# EAGLE design DMGC-IPS-01_2-4 (EAGLE 9.6.2)
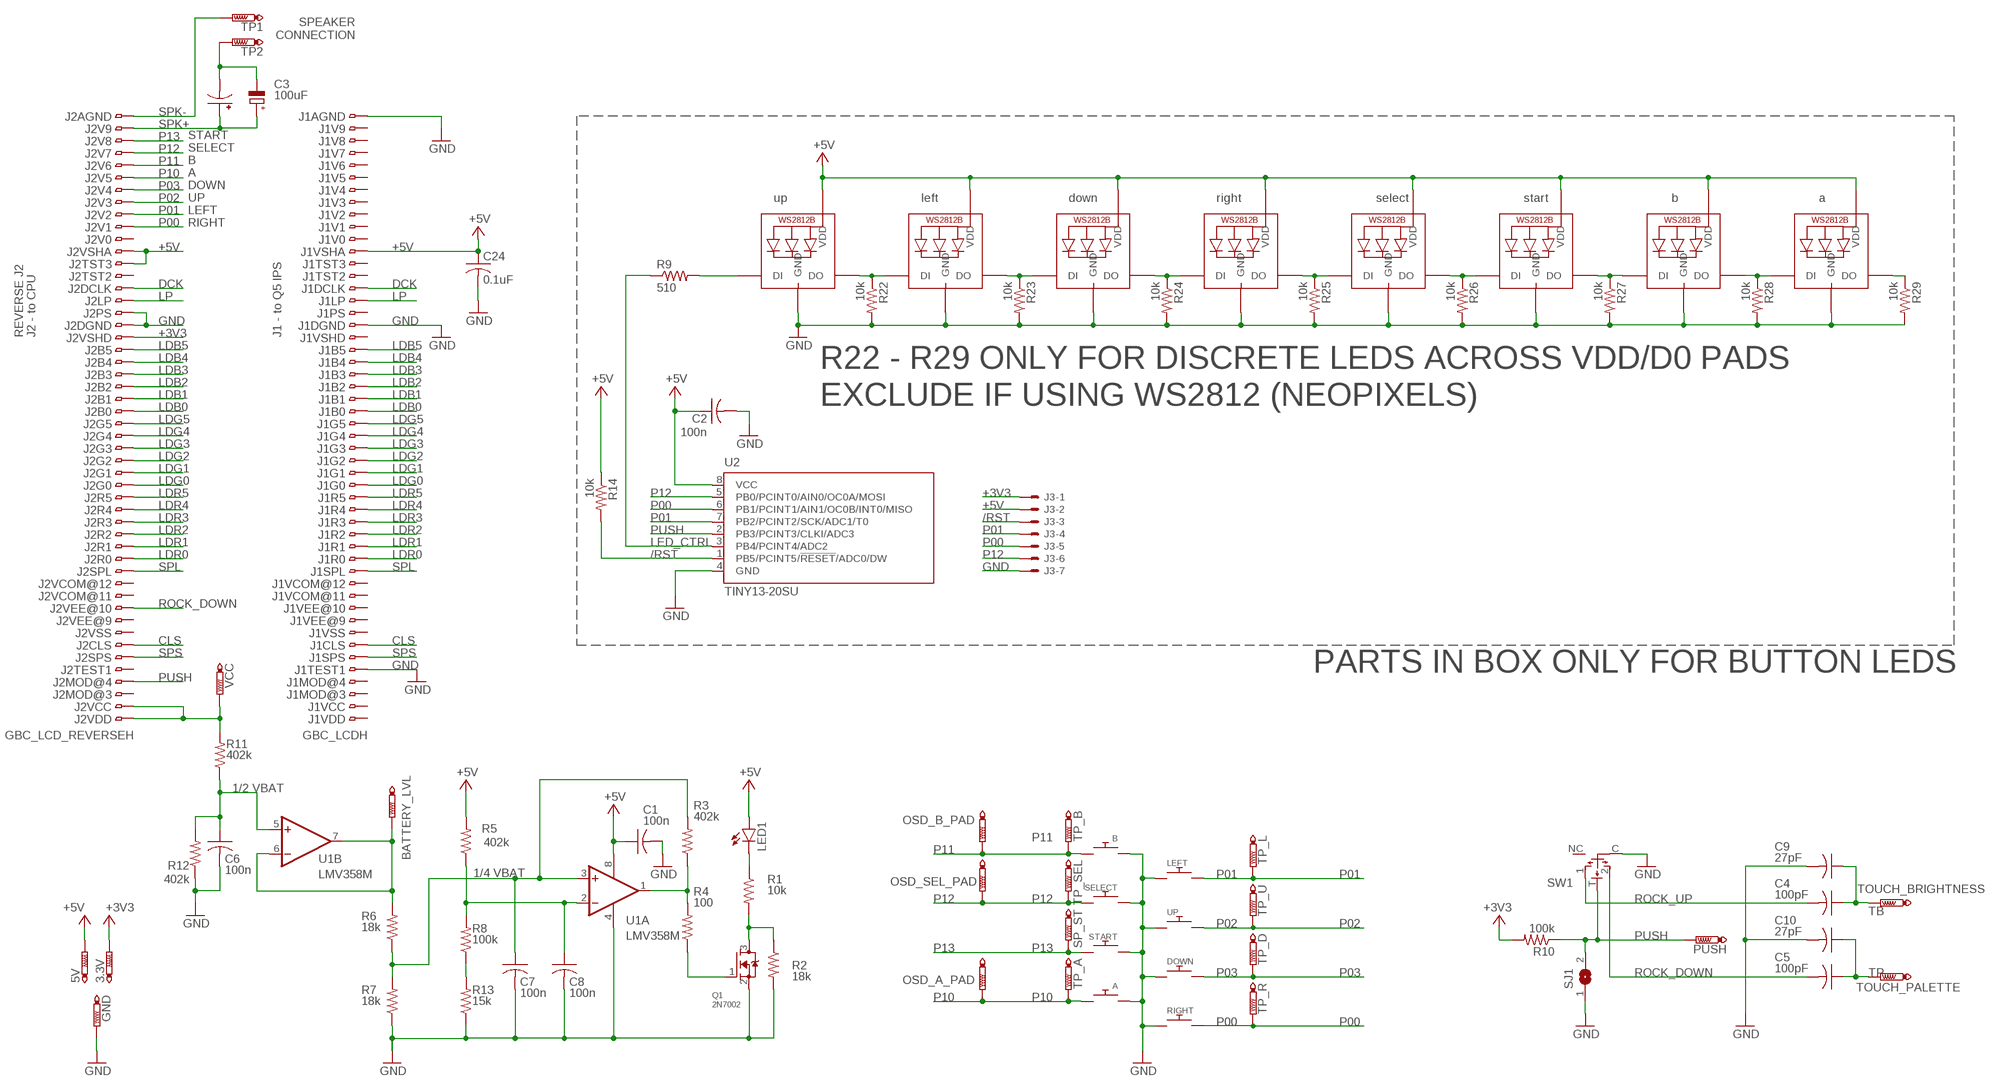
[diagram p0: schematic, sheet 1]

## Parts
3.3V  PTR1TP20R  [TP20R]
5V  PTR1TP20R  [TP20R]
A  DMG-BTN  DMG_BTN1  [DMG_BTN1]
B  DMG-BTN  DMG_BTN1  [DMG_BTN1]
BATTERY_LVL  PTR1TP20R  [TP20R]
C1  100n  C-USC0603  [C0603]
C2  100n  C-USC0603  [C0603]
C3  100uF  CPOL-USCT3528  [CT3528]
C3TH  CPOL-EUE2,5-6E  [E2,5-6E]
C4  100pF  C-USC0603  [C0603]
C5  100pF  C-USC0603  [C0603]
C6  100n  C-USC0603  [C0603]
C7  100n  C-USC0603  [C0603]
C8  100n  C-USC0603  [C0603]
C9  27pF  C-USC0603  [C0603]
C10  27pF  C-USC0603  [C0603]
C24  0.1uF  C-USC0603  [C0603]
DOWN  DMG-BTN  DMG_BTN1  [DMG_BTN1]
GND  PTR1TP20R  [TP20R]
J1  GBC_LCDH  [62684-502100AHLF]
J2  GBC_LCD_REVERSEH  [62684-502100AHLF_REVERSE]
J3  C-GRID-07-15-91  [15-91-07]
LED1  LED3MM  [LED3MM]
LED10  WS2812B3535  [LED3535]
LED11  WS2812B3535  [LED3535]
LED12  WS2812B3535  [LED3535]
LED13  WS2812B3535  [LED3535]
LED14  WS2812B3535  [LED3535]
LED15  WS2812B3535  [LED3535]
LED16  WS2812B3535  [LED3535]
LED17  WS2812B3535  [LED3535]
LEFT  DMG-BTN  DMG_BTN1  [DMG_BTN1]
OSD_A_PAD  PTR1TP20R  [TP20R]
OSD_B_PAD  PTR1TP20R  [TP20R]
OSD_SEL_PAD  PTR1TP20R  [TP20R]
PUSH  PTR1TP20R  [TP20R]
Q1  2N7002  MOSFET-NREFLOW  [SOT23]
R1  10k  R-US_R0603  [R0603]
R2  18k  R-US_R0603  [R0603]
R3  402k  R-US_R0603  [R0603]
R4  100  R-US_R0603  [R0603]
R5  402k  R-US_R0603  [R0603]
R6  18k  R-US_R0603  [R0603]
R7  18k  R-US_R0603  [R0603]
R8  100k  R-US_R0603  [R0603]
R9  510  R-US_R0603  [R0603]
R10  100k  R-US_R0603  [R0603]
R11  402k  R-US_R0603  [R0603]
R12  402k  R-US_R0603  [R0603]
R13  15k  R-US_R0603  [R0603]
R14  10k  R-US_R0603  [R0603]
R22  10k  R-US_R0603  [R0603]
R23  10k  R-US_R0603  [R0603]
R24  10k  R-US_R0603  [R0603]
R25  10k  R-US_R0603  [R0603]
R26  10k  R-US_R0603  [R0603]
R27  10k  R-US_R0603  [R0603]
R28  10k  R-US_R0603  [R0603]
R29  10k  R-US_R0603  [R0603]
RIGHT  DMG-BTN  DMG_BTN1  [DMG_BTN1]
SELECT  DMG-BTN  DMG_BTN2_TACT2  [DMG_BTN2_TACT2]
SJ1  SJ  [SJ]
SP_ST  PTR1TP20R  [TP20R]
START  DMG-BTN  DMG_BTN2_TACT2  [DMG_BTN2_TACT2]
SW1  NAV_SWITCH  [NAV_SWITCH]
TOUCH_BRIGHTNESS  PTR1TP20R  [TP20R]
TOUCH_PALETTE  PTR1TP20R  [TP20R]
TP1  PTR1PAD1-13  [P1-13]
TP2  PTR1PAD1-13  [P1-13]
TP_A  PTR1TP20R  [TP20R]
TP_B  PTR1TP20R  [TP20R]
TP_D  PTR1TP20R  [TP20R]
TP_L  PTR1TP20R  [TP20R]
TP_R  PTR1TP20R  [TP20R]
TP_SEL  PTR1TP20R  [TP20R]
TP_U  PTR1TP20R  [TP20R]
U1  LMV358M  [SO08]
U2  TINY13-20SU  [8S2]
UP  DMG-BTN  DMG_BTN1  [DMG_BTN1]
VCC  PTR1TP20R  [TP20R]

## Nets
+3V3: 3.3V.TP J2.19 J3.1 R10.2
+5V: 5V.TP C1.1 C2.1 C24.1 J1.39 J2.12 J2.13 J3.2 LED1.A LED10.4(VDD) LED11.4(VDD) LED12.4(VDD) LED13.4(VDD) LED14.4(VDD) LED15.4(VDD) LED16.4(VDD) LED17.4(VDD) R5.2 R14.1 U1.8(P:V+) U2.8(VCC)
/RST: J3.3 R14.2 U2.1(PB5/PCINT5/!RESET!/ADC0/DW)
BATT: J2.49 J2.50 R11.2 VCC.TP
CLS: J1.7 J2.44
DCK: J1.36 J2.15
GND: A.P$2 B.P$2 C1.2 C2.2 C6.2 C7.2 C8.2 C9.2 C10.2 C24.2 DOWN.P$2 GND.TP J1.5 J1.33 J1.50 J2.17 J2.18 J3.7 LED10.2(GND) LED11.2(GND) LED12.2(GND) LED13.2(GND) LED14.2(GND) LED15.2(GND) LED16.2(GND) LED17.2(GND) LEFT.P$2 Q1.2(S) R2.2 R7.1 R12.1 R13.1 R22.2 R23.2 R24.2 R25.2 R26.2 R27.2 R28.2 R29.2 RIGHT.P$2 SELECT.P$1 SJ1.1 START.P$1 SW1.C U1.4(P:V-) U2.4(GND) UP.P$2
LDB0: J1.26 J2.25
LDB1: J1.27 J2.24
LDB2: J1.28 J2.23
LDB3: J1.29 J2.22
LDB4: J1.30 J2.21
LDB5: J1.31 J2.20
LDG0: J1.20 J2.31
LDG1: J1.21 J2.30
LDG2: J1.22 J2.29
LDG3: J1.23 J2.28
LDG4: J1.24 J2.27
LDG5: J1.25 J2.26
LDR0: J1.14 J2.37
LDR1: J1.15 J2.36
LDR2: J1.16 J2.35
LDR3: J1.17 J2.34
LDR4: J1.18 J2.33
LDR5: J1.19 J2.32
LED_CTRL: R9.1 U2.3(PB4/PCINT4/ADC2)
LP: J1.35 J2.16
N$1: Q1.3(D) R1.2 R2.1
N$2: LED1.K(C) R1.1
N$3: BATTERY_LVL.TP R6.2 U1.6(B:-IN) U1.7(B:OUT)
N$4: LED13.1(DO) LED16.3(DI) R27.1
N$5: LED15.3(DI) LED16.1(DO) R28.1
N$6: LED10.1(DO) LED14.3(DI) R22.1
N$7: C8.1 R5.1 R8.2 U1.2(A:-IN)
N$9: LED11.3(DI) LED14.1(DO) R23.1
N$10: LED11.1(DO) LED12.3(DI) R24.1
N$11: LED12.1(DO) LED17.3(DI) R25.1
N$12: LED13.3(DI) LED17.1(DO) R26.1
N$13: LED15.1(DO) R29.1
N$14: LED10.3(DI) R9.2
N$15: C6.1 R11.1 R12.2 U1.5(B:+IN)
N$19: C3.- C3TH.- TP2.TP
N$20: R8.1 R13.2
N$21: C7.1 R3.2 R6.1 R7.2 U1.3(A:+IN)
N$31: R3.1 R4.2 U1.1(A:OUT)
P00: J2.10 J3.5 RIGHT.P$1 TP_R.TP U2.6(PB1/PCINT1/AIN1/OC0B/INT0/MISO)
P01: J2.9 J3.4 LEFT.P$1 TP_L.TP U2.7(PB2/PCINT2/SCK/ADC1/T0)
P02: J2.8 TP_U.TP UP.P$1
P03: DOWN.P$1 J2.7 TP_D.TP
P10: A.P$1 J2.6 OSD_A_PAD.TP TP_A.TP
P11: B.P$1 J2.5 OSD_B_PAD.TP TP_B.TP
P12: J2.4 J3.6 OSD_SEL_PAD.TP SELECT.P$2 TP_SEL.TP U2.5(PB0/PCINT0/AIN0/OC0A/MOSI)
P13: J2.3 SP_ST.TP START.P$2
PSU_EN: Q1.1(G) R4.1
PUSH: J2.47 PUSH.TP R10.1 SJ1.2 SW1.T U2.2(PB3/PCINT3/CLKI/ADC3)
ROCK_DOWN: C5.2 J2.41 SW1.2
ROCK_UP: C4.2 SW1.1
SPK+: C3.+ C3TH.+ J2.2
SPK-: J2.1 TP1.TP
SPL: J1.13 J2.38
SPS: J1.6 J2.45
TB: C4.1 C9.1 TOUCH_BRIGHTNESS.TP
TP: C5.1 C10.1 TOUCH_PALETTE.TP
Unconnected: J1.1 J1.2 J1.3 J1.4 J1.8 J1.9 J1.10 J1.11 J1.12 J1.32 J1.34 J1.37 J1.38 J1.40 J1.41 J1.42 J1.43 J1.44 J1.45 J1.46 J1.47 J1.48 J1.49 J2.11 J2.14 J2.39 J2.40 J2.42 J2.43 J2.46 J2.48 SW1.NC

## Notes on the sheet
- SPEAKER
  CONNECTION
- up | left | down | right | select | start | b | a
- START
  SELECT
  B
  A
  DOWN
  UP
  LEFT
  RIGHT
- REVERSE J2 | J2 - to CPU | J1 - to Q5 IPS
- R22 - R29 ONLY FOR DISCRETE LEDS ACROSS VDD/D0 PADS
- EXCLUDE IF USING WS2812 (NEOPIXELS)
- PARTS IN BOX ONLY FOR BUTTON LEDS
- 1/2 VBAT
- 1/4 VBAT

## Library data of the parts
3.3V 5V BATTERY_LVL GND OSD_A_PAD OSD_B_PAD OSD_SEL_PAD PUSH SP_ST TOUCH_BRIGHTNESS TOUCH_PALETTE TP1 TP2 TP_A TP_B TP_D TP_L TP_R TP_SEL TP_U VCC = testpad:PTR1: TEST PIN
A B DOWN LEFT RIGHT UP = gameboy:DMG_BTN1: A, B, Up, Down, Left, Right button pads for DMG
C1 C2 C4-C10 C24 = rcl:C-US: CAPACITOR, American symbol; SPICEPREFIX: C
C3 = rcl:CPOL-US: POLARIZED CAPACITOR, American symbol; SPICEPREFIX: C
C3TH = rcl:CPOL-EU: POLARIZED CAPACITOR, European symbol; SPICEPREFIX: C
J1 = gameboy:GBC_LCD: 0.5mm Pitch Connectors For FPC/FFC Source: Data sheet <http://www.hirose.co.jp/cataloge_hp/e58605370.pdf>; MPN: 62684-502100AHLF; OC_FARNELL: 1324557; OC_NEWARK: 34M6181
J2 = gameboy:GBC_LCD_REVERSE: 0.5mm Pitch Connectors For FPC/FFC Source: Data sheet <http://www.hirose.co.jp/cataloge_hp/e58605370.pdf>
J3 = con-molex:C-GRID-07: CONNECTOR wire to board 2.54 mm (0.100") pitch header; MF: MOLEX; OC_FARNELL: unknown; OC_NEWARK: unknown
LED1 = led:LED: LED OSRAM: - CHIPLED LG R971, LG N971, LY N971, LG Q971, LY Q971, LO R971, LY R971 LH N974, LH R974 LS Q976, LO Q976, LY Q976 LO Q996 - Hyper CHIPLED LW Q18S LB Q993, LB Q99A, LB R99A - SideLED LS A670, LO A670, LY A670, LG A670, LP A670 LB A673, LV A673, LT A673, LW A673 LH A674 LY A675 LS A676, LA A676, LO A676, LY A676, LW A676 LS A679, LY A679, LG A679 - Hyper Micro SIDELED® LS Y876, LA Y876, LO Y876, LY Y876 LT Y87S - SmartLED LW L88C, LW L88S LB L89C, LB L89S, LG L890 LS L89K, LO L89K, LY L89K LS L896, LA L896, LO L896, LY L896 - TOPLED LS T670, LO T670, LY T670, LG T670, LP T670 LSG T670, LSP T670, LSY T670, LOP T670, LYG T670 LG T671, LOG T671, LSG T671 LB T673, LV T673, LT T673, LW T673 LH T674 LS T676, LA T676, LO T676, LY T676, LB T676, LH T676, LSB T676, LW T676 LB T67C, LV T67C, LT T67C, LS T67K, LO T67K, LY T67K, LW E67C LS E67B, LA E67B, LO E67B, LY E67B, LB E67C, LV E67C, LT E67C LW T67C LS T679, LY T679, LG T679 LS T770, LO T770, LY T770, LG T770, LP T770 LB T773, LV T773, LT T773, LW T773 LH T774 LS E675, LA E675, LY E675, LS T675 LS T776, LA T776, LO T776, LY T776, LB T776 LHGB T686 LT T68C, LB T68C - Hyper Mini TOPLED® LB M676 - Mini TOPLED Santana® LG M470 LS M47K, LO M47K, LY M47K Source: http://www.osram.convergy.de LUXEON: - LUMILED® LXK2-PW12-R00, LXK2-PW12-S00, LXK2-PW14-U00, LXK2-PW14-V00 LXK2-PM12-R00, LXK2-PM12-S00, LXK2-PM14-U00 LXK2-PE12-Q00, LXK2-PE12-R00, LXK2-PE12-S00, LXK2-PE14-T00, LXK2-PE14-U00 LXK2-PB12-K00, LXK2-PB12-L00, LXK2-PB12-M00, LXK2-PB14-N00, LXK2-PB14-P00, LXK2-PB14-Q00 LXK2-PR12-L00, LXK2-PR12-M00, LXK2-PR14-Q00, LXK2-PR14-R00 LXK2-PD12-Q00, LXK2-PD12-R00, LXK2-PD12-S00 LXK2-PH12-R00, LXK2-PH12-S00 LXK2-PL12-P00, LXK2-PL12-Q00, LXK2-PL12-R00 Source: www.luxeon.com KINGBRIGHT: KA-3528ASYC Source: www.kingbright.com
LED10-LED17 = adafruit:WS2812B
Q1 = adafruit:MOSFET-N: N-Channel Mosfet 2N7002E - 60V 260mA SOT23 [Digikey: 2N7002ET1GOSTR-ND] - REEL BSH103 - 30V 850mA SOT23 [Digikey: 568-5013-1-ND]
R1-R14 R22-R29 = rcl:R-US_: RESISTOR, American symbol; SPICEPREFIX: R
SELECT START = gameboy:DMG_BTN2_TACT: Start, Select button pads for DMG
SJ1 = jumper:SJ: SMD solder JUMPER
SW1 = gameboy:NAV_SWITCH: TINY SWITCH ON OFF MOM Source: http://www2.produktinfo.conrad.com/datenblaetter/700000-724999/705152-da-01-de-Subminiaturschalter_TL_36YO.pdf
U1 = linear:LMV358?*: Dual General Purpose, Low Voltage, Rail-to-Rail Output Operational Amplifiers Source: http://www.national.com/mpf/LM/LMV321.html http://www.national.com/dt/lmv_qual.pdf
U2 = atmel:TINY13: 8-bit AVR Microcontroller with 1K Bytes In-System Programmable Flash Source: http://www.atmel.com/dyn/resources/prod_documents/2535S.pdf; MPN: ATTINY13-20SU; OC_FARNELL: 9171568; OC_NEWARK: 96K6522

## Board
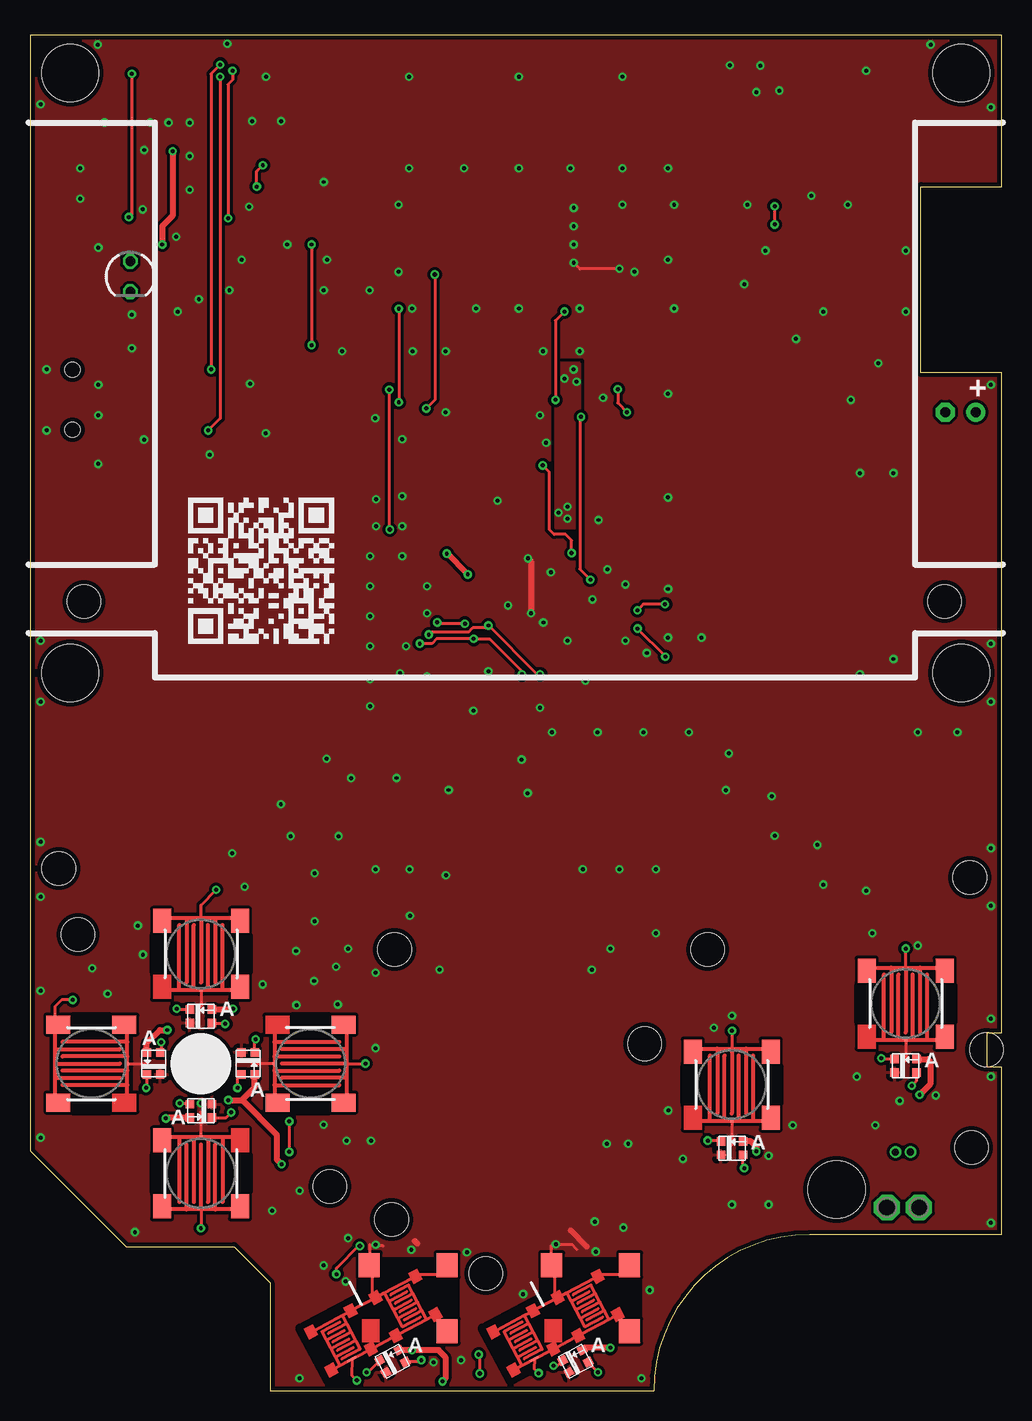
[diagram p1: board, top side]
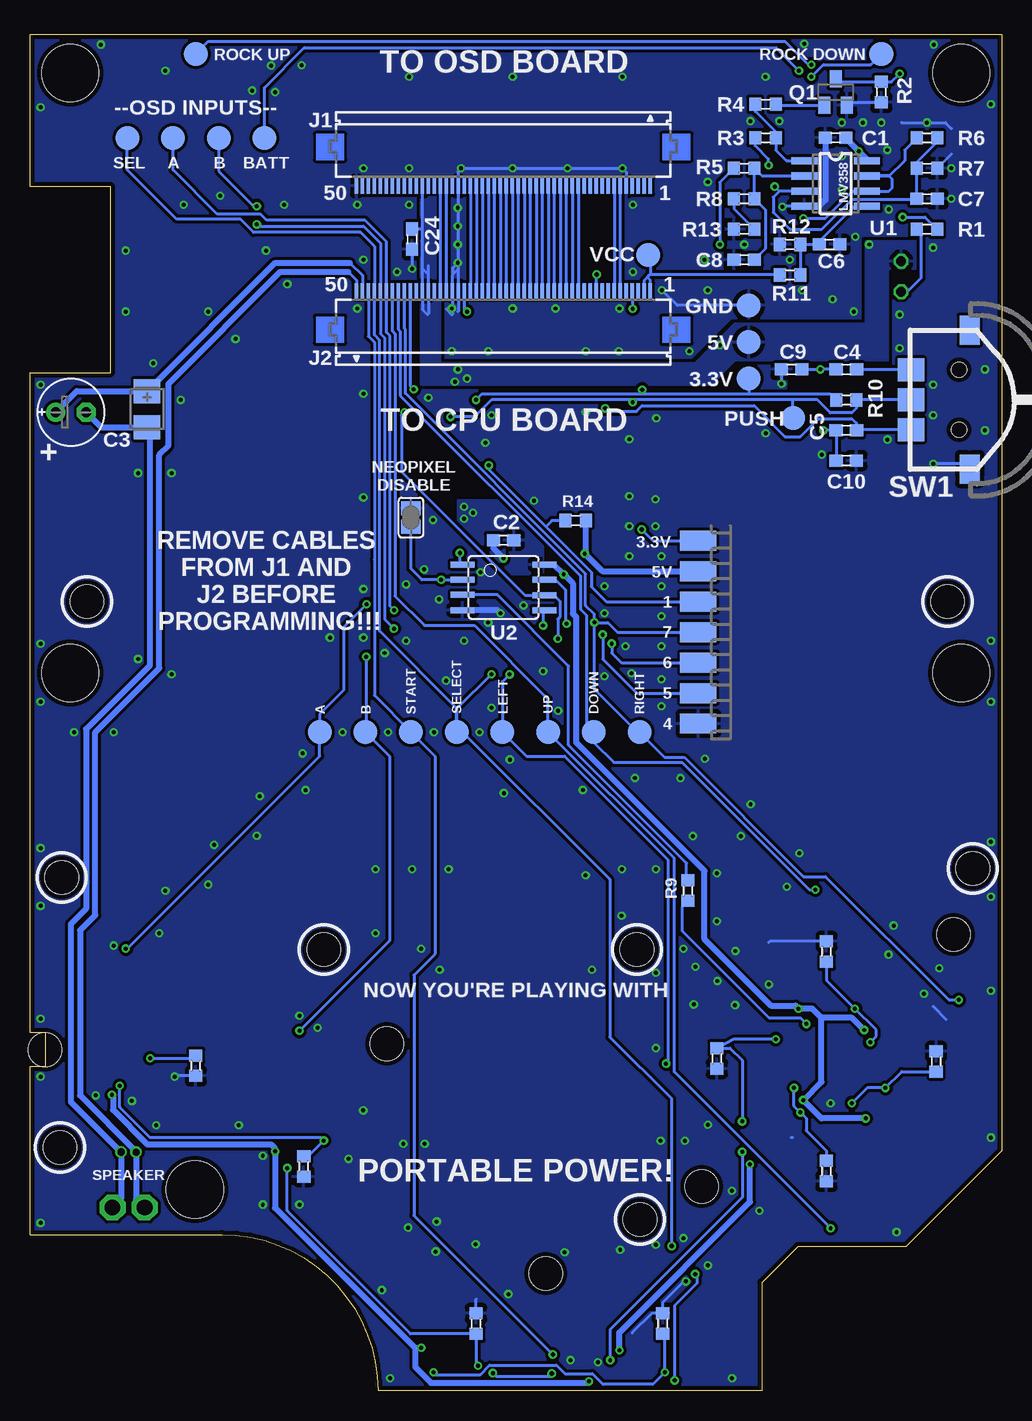
[diagram p2: board, bottom side, seen from below]

Size 81 x 113 mm. Coordinates in mm from the lower left corner, seen from the top.
Outline: 0,20 8,12 17,12 20,9 20,0 52,0 arc-90 65,13 81,13 81,27 79.75,27 79.75,29.8 81,29.8 81,84.84 74.28,84.84 74.28,100.33 81,100.33 81,113 0,113 0,20
Copper layers (1*16): Top 0.0356mm / dielectric 1.5011mm / Bottom 0.0356mm
Design rules "jlcpcb *": minimum track width 8mil, minimum drill 13mil, track to track 7mil, track to pad 7mil, pad to pad 7mil, via to via 7mil, smd to smd 5mil, copper to edge 15mil, drill to drill 22mil, minimum pad ring 7mil, minimum via ring 7mil, stop-mask expansion 2.5mil, vias tented up to drill 14mil, thermal gap 15mil
Holes 4.75 mm at 3.35,59.8 77.65,59.8 3.35,109.8 77.65,109.8 67.25,16.75
Holes 2.8 mm at 76.25,65.75 2.4,43.5 78.35,42.75 78.5,20.25 30.4,36.75 56.5,36.75 30.15,14.25 25,17 38,9.75 79.75,28.4 4,38 4.5,65.75 51.25,28.9
bRestrict: area 45.1,91.4 to 48.4,91.9; area 47.1,92.2 to 47.4,92.5; area 1.8,76.3 to 3.5,78; area 17,83.5 to 17.5,84.3

### Footprints (pad centres in the part's own frame; a part is rotated, then mirrored left to right if it is on the bottom)
TP20R = smd 2 x 2: TP 0,0
DMG_BTN1 = smd 1.5 x 2: P$1 -3.25,2.75; P$3 3.25,2.75; P$4 3.25,-2.75 | smd 0.25 x 0.25: P$2 0,-3
C0603 = smd 1.1 x 1: 1 -0.85,0; 2 0.85,0
CT3528 = smd 2 x 2.2: + -1.5,0; - 1.5,0
E2,5-6E = drill 0.813 pad 1.575: + -1.27,0 | drill 0.813 pad 1.575 octagon: - 1.27,0
62684-502100AHLF = smd 0.3 x 1.3: 1 -12.25,3.25; 2 -11.75,3.25; 3 -11.25,3.25; 4 -10.75,3.25; 5 -10.25,3.25; 6 -9.75,3.25; 7 -9.25,3.25; 8 -8.75,3.25; 9 -8.25,3.25; 10 -7.75,3.25; 11 -7.25,3.25; 12 -6.75,3.25; 13 -6.25,3.25; 14 -5.75,3.25; 15 -5.25,3.25; 16 -4.75,3.25; 17 -4.25,3.25; 18 -3.75,3.25; 19 -3.25,3.25; 20 -2.75,3.25; 21 -2.25,3.25; 22 -1.75,3.25; 23 -1.25,3.25; 24 -0.75,3.25; 25 -0.25,3.25; 26 0.25,3.25; 27 0.75,3.25; 28 1.25,3.25; 29 1.75,3.25; 30 2.25,3.25; 31 2.75,3.25; 32 3.25,3.25; 33 3.75,3.25; 34 4.25,3.25; 35 4.75,3.25; 36 5.25,3.25; 37 5.75,3.25; 38 6.25,3.25; 39 6.75,3.25; 40 7.25,3.25; 41 7.75,3.25; 42 8.25,3.25; 43 8.75,3.25; 44 9.25,3.25; 45 9.75,3.25; 46 10.25,3.25; 47 10.75,3.25; 48 11.25,3.25; 49 11.75,3.25; 50 12.25,3.25
62684-502100AHLF_REVERSE = smd 0.3 x 1.3: 1 -12.25,3.25; 2 -11.75,3.25; 3 -11.25,3.25; 4 -10.75,3.25; 5 -10.25,3.25; 6 -9.75,3.25; 7 -9.25,3.25; 8 -8.75,3.25; 9 -8.25,3.25; 10 -7.75,3.25; 11 -7.25,3.25; 12 -6.75,3.25; 13 -6.25,3.25; 14 -5.75,3.25; 15 -5.25,3.25; 16 -4.75,3.25; 17 -4.25,3.25; 18 -3.75,3.25; 19 -3.25,3.25; 20 -2.75,3.25; 21 -2.25,3.25; 22 -1.75,3.25; 23 -1.25,3.25; 24 -0.75,3.25; 25 -0.25,3.25; 26 0.25,3.25; 27 0.75,3.25; 28 1.25,3.25; 29 1.75,3.25; 30 2.25,3.25; 31 2.75,3.25; 32 3.25,3.25; 33 3.75,3.25; 34 4.25,3.25; 35 4.75,3.25; 36 5.25,3.25; 37 5.75,3.25; 38 6.25,3.25; 39 6.75,3.25; 40 7.25,3.25; 41 7.75,3.25; 42 8.25,3.25; 43 8.75,3.25; 44 9.25,3.25; 45 9.75,3.25; 46 10.25,3.25; 47 10.75,3.25; 48 11.25,3.25; 49 11.75,3.25; 50 12.25,3.25
15-91-07 = smd 1.651 x 3.048: 1 -7.62,-2.032; 2 -5.08,-2.032; 3 -2.54,-2.032; 4 0,-2.032; 5 2.54,-2.032; 6 5.08,-2.032; 7 7.62,-2.032
LED3MM = drill 0.813 octagon: A -1.27,0; K 1.27,0
LED3535 = smd 0.7 x 0.7: 1 -0.915,0.555; 2 -0.915,-0.555; 3 0.915,-0.555; 4 0.915,0.555
SOT23 = smd 1 x 1.4: 1 -0.95,-1.1; 2 0.95,-1.1; 3 0,1.1
R0603 = smd 1 x 1.1: 1 -0.85,0; 2 0.85,0
DMG_BTN2_TACT2 = smd 0.8 x 0.2: P$1 1.97,4.072; P$2 -2.947,-1.81 | smd 1.75 x 2 rotated 332: P$4 1.991,4.426; P$5 7.73,1.375; P$6 5.148,-3.481
SJ = smd 1.168 x 1.6: 1 -0.762,0; 2 0.762,0
NAV_SWITCH = smd 1.9 x 2.2: 1 -2.5,-4; 2 2.5,-4; T 0,-4 | smd 2.4 x 1.7: C 5.8,0.9; NC -5.8,0.9 | hole 1.25: -2.5,0; 2.5,0
P1-13 = drill 1.321 pad 2.159 octagon: TP 0,0
SO08 = smd 0.6 x 2.2: 1 -1.905,-2.6; 2 -0.635,-2.6; 3 0.635,-2.6; 4 1.905,-2.6; 5 1.905,2.6; 6 0.635,2.6; 7 -0.635,2.6; 8 -1.905,2.6
8S2 = smd 0.5 x 2: 1 -1.905,-3.404; 2 -0.645,-3.404; 3 0.625,-3.404; 4 1.895,-3.404; 5 1.905,3.404; 6 0.635,3.404; 7 -0.635,3.404; 8 -1.905,3.404

### Placement (x,y rotation side)
3.3V  21.07,84.33 0 bottom
5V  21.07,87.38 0 bottom
A  73,32.25 0 top
B  58.5,25.5 0 top
BATTERY_LVL  61.45,104.39 0 bottom
C1  13.83,104.39 180 bottom
C2  41.52,70.87 180 bottom
C3  71.23,81.79 270 bottom
C3TH  77.58,81.53 0 bottom
C4  12.94,85.09 0 bottom
C5  12.94,80.01 0 bottom
C6  14.34,95.5 0 bottom
C7  6.21,99.31 0 bottom
C8  21.45,94.23 180 bottom
C9  17.5,85.09 180 bottom
C10  12.95,77.5 0 bottom
C24  49.14,95.95 270 bottom
DOWN  14.25,18.11 180 top
GND  21.07,90.42 0 bottom
J1  41.54,103.63 180 bottom
J2  41.54,88.39 0 bottom
J3  23.25,63.2 270 bottom
LED1  8.37,92.84 270 top
LED10  14.24,31.19 0 top
LED11  14.25,23.31 180 top
LED12  18.19,27.26 270 top
LED13  45.48,2.44 28 top
LED14  10.3,27.26 90 top
LED15  73.01,27.06 0 top
LED16  58.53,20.21 0 top
LED17  30.22,2.44 28 top
LEFT  5.11,27.25 90 top
OSD_A_PAD  69.08,104.39 0 bottom
OSD_B_PAD  65.27,104.39 0 bottom
OSD_SEL_PAD  72.89,104.39 0 bottom
PUSH  17.39,81.03 0 bottom
Q1  13.83,108.2 0 bottom
R1  6.21,96.77 0 bottom
R2  10.02,108.2 270 bottom
R3  19.67,104.39 180 bottom
R4  19.67,107.19 180 bottom
R5  21.45,101.85 180 bottom
R6  6.21,104.39 180 bottom
R7  6.21,101.85 180 bottom
R8  21.45,99.31 0 bottom
R9  26.14,41.66 270 bottom
R10  12.94,82.55 180 bottom
R11  17.64,92.96 180 bottom
R12  17.64,95.5 0 bottom
R13  21.45,96.77 0 bottom
R14  35.5,72.5 180 bottom
R22  14.59,36.58 90 bottom
R23  5.45,27.42 90 bottom
R24  14.6,18.29 270 bottom
R25  23.73,27.69 270 bottom
R26  28.25,5.59 90 bottom
R27  43.81,5.58 90 bottom
R28  58.17,18.68 270 bottom
R29  67.18,27.06 270 bottom
RIGHT  23.39,27.25 270 top
SELECT  28.6,5.6 28 top
SJ1  49.25,72.75 270 bottom
SP_ST  49.23,54.86 0 bottom
START  43.8,5.6 28 top
SW1  3.54,82.57 270 bottom
TOUCH_BRIGHTNESS  67.17,111.38 0 bottom
TOUCH_PALETTE  10.02,111.38 0 bottom
TP1  71.45,15.25 0 top
TP2  74.12,15.25 0 top
TP_A  56.85,54.86 0 bottom
TP_B  53.04,54.86 0 bottom
TP_D  37.8,54.86 0 bottom
TP_L  30.18,54.86 0 bottom
TP_R  41.61,54.86 0 bottom
TP_SEL  45.42,54.86 0 bottom
TP_U  33.99,54.86 0 bottom
U1  13.83,100.58 270 bottom
U2  41.52,66.93 270 bottom
UP  14.25,36.39 0 top
VCC  29.45,94.61 0 bottom

### Tracks (layer width: path | path; a pad name or v marks a point on that pad's centre or on a via)
+3V3  (via drill 0.33, 0.35)
  Top 0.254: v44.56,89.92 43.8,89.15 v43.8,82.55 | v29.95,83.4 29.95,71.8 v30,71.75
  Bottom 0.254: v43.8,82.55 43.29,83.06 29.95,83.06 | 29.95,83.06 21.07,83.06 | 21.07,83.06 14.3,83.06 R10.2 | v44.56,89.92 44.79,90.14 J2.19 | 3.3V.TP 21.07,83.06 | 29.95,83.06 v29.95,83.4 | v30,71.75 29.07,70.82 J3.1
+5V  (via drill 0.33)
  Top 0.254: v23.48,95.5 v23.48,87.12
  Top 0.506: v36.5,68.01 v34.75,69.75
  Top 0.508: v11.89,103.28 11.89,97.89 11.04,97.03 v11.04,95.5 | LED15.4 74.86,27.62 75.04,27.43 75.04,25.51 v74.17,24.64 | v60.57,19.93 60.57,20.31 60.11,20.76 LED16.4 | v48.38,3.56 46.22,3.56 LED13.4 | v34.39,0.76 34.64,1.02 34.64,2.79 34.08,3.36 v31.86,3.36 LED17.4 | v20.97,18.87 20.6,19.24 20.6,21.29 17.68,24.21 | LED12.4 18.75,25.29 17.68,24.21 | LED11.4 11.4,22.75 v11.33,22.68 | v16.54,24.2 17.66,24.2 17.68,24.21 | v16.92,31.82 16.92,31.75 LED10.4 | LED14.4 9.75,28.95 10.84,30.04 v11.46,30.04 | v34.75,69.75
  Bottom 0.254: 48.29,93.47 J2.12 48.29,90.09 47.87,89.66 47.79,89.74 J2.13 47.79,92.97 | 48.29,93.47 48.29,96.77 | 48.29,96.77 J1.39 | 47.79,92.97 47.79,93.73 | 47.79,92.97 48.29,93.47 | C24.1 48.31,96.8 48.29,96.77 | 11.23,102.62 U1.8 | R5.2 23.48,100.67 v23.48,95.5
  Bottom 0.508: C1.1 12.98,104.37 v11.89,103.28 11.23,102.62 | v74.17,24.64 74.08,24.55 74.08,23.39 71.21,20.52 60.91,20.52 60.57,20.18 v60.57,19.93 60.57,15.21 48.91,3.56 | 48.91,3.56 v48.38,3.56 | 48.91,3.56 48.9,3.54 48.9,1.97 47.56,0.64 34.52,0.64 v34.39,0.76 | v31.86,3.36 31.86,4.83 20.97,15.72 v20.97,18.87 | v11.33,22.68 15.01,22.68 v16.54,24.2 15.01,25.73 15.01,31.05 | 15.01,31.05 15.77,31.82 v16.92,31.82 17.17,32.07 19.23,32.07 24.75,37.59 24.75,43.3 35.45,54 35.45,64.45 35.75,64.75 35.75,67.26 v36.5,68.01 37.33,68.83 U2.8 | v11.46,30.04 12.47,31.05 15.01,31.05 | R14.1 34.65,69.85 v34.75,69.75 33.28,68.28 J3.2
  other vias: 44.82,72.64 44.82,73.66 44.06,73.15 44.56,84.33 45.33,85.09 45.58,84.07
  pour Bottom: 46.85,100.58 46.85,83.82 48.37,83.82 48.37,100.58
  pour Bottom (isolate 0.254): 6.72,95.76 6.72,93.47 9.51,93.47 9.51,85.85 22.21,85.85 24.24,83.82 48.37,83.82 48.37,85.6 25.51,85.6 22.21,88.9 11.29,88.9 11.29,95.76
  pour Top (isolate 0.254): 43.8,85.6 43.8,71.88 45.83,71.88 45.83,85.6
  pour Bottom (isolate 0.254): 38.21,68.07 38.21,70.61 41.77,74.17 45.33,74.17 45.33,71.88 41.52,68.07
/RST  (via drill 0.35)
  Top 0.254: v45.15,69.8 45.15,70.85 44.65,71.35 43.7,71.35 43.31,71.74 43.31,76.54 v42.75,77.1
  Bottom 0.254: U2.1 45.15,69.06 v45.15,69.8 | v42.75,77.1 42.75,76.75 38,72 | J3.3 32.94,65.74 34.2,67 34.2,68.2 38,72 | R14.2 37.5,72.5 38,72
BATT
  Bottom 0.254: R11.2 29.35,92.96 | 29.35,92.96 29.54,92.78 | VCC.TP 29.28,94.61 29.28,93.03 29.35,92.96 | J2.49 29.79,92.52 29.54,92.78 | J2.50 29.29,92.53 29.54,92.78
CLS
  Bottom 0.254: J1.7 J2.44
DCK
  Bottom 0.254: J2.15 J1.36
GND  (via drill 0.33, 0.35)
  Top 0.254: v49.14,93.48 45.83,93.48 v45.33,93.98 | 11.78,33.37 14.25,33.37 | 14.25,33.37 14.25,32.02 | UP.P$2 14.25,33.37 | LEFT.P$2 9.58,27.25 9.6,27.27 | DOWN.P$2 14.25,23.17 14.2,23.22 | RIGHT.P$2 18.52,27.25 18.5,27.27 | B.P$2 58.52,20.99 | 58.52,20.99 58.53,20.48 | A.P$2 73.01,27.51 72.95,27.45 | 58.52,20.99 | v43.84,12.18 45.17,12.18 45.58,11.77 | 29.44,12.06 28.92,12.06 v28.82,12.16 | SELECT.P$1 28.35,10.04 28.35,12.15 | 43.45,12.1 43.45,10.3 START.P$1
  Top 0.508: v41.52,69.34 41.77,69.09 v41.77,64.77 | 32.29,12.26 32.1,12.46 | 46.41,12 45.08,13.32
  Bottom 0.254: 45.29,93.47 J2.18 45.29,89.95 45.33,89.92 | 45.29,93.47 J1.33 45.29,101.64 v45.07,101.85 v31.61,101.85 31.29,101.53 J1.5 | 45.79,92.97 J2.17 45.79,89.71 45.83,89.66 46.29,90.12 | 45.79,92.97 45.29,93.47 | 16.12,98.68 U1.4 18.24,98.68 v18.26,98.65 | R2.2 12.56,107.35 12.81,107.1 Q1.2 | 8.33,105.66 4.69,105.66 4.18,105.16 | 4.18,103.04 R7.1 | SW1.C 2.69,77.22 v5.69,77.22 | C24.2 v49.14,93.48 | v45.33,93.98 45.79,93.52 45.79,92.97 | R27.2 43.81,7.61 | 17.4,21.08 17.56,21.08 | 4.61,30.91 5.7,32 | v54.44,19.3 54.44,19.09 | R29.2 68.89,26.21 v68.94,26.16 | R22.2 19.33,37.43 19.42,37.34 | v28.31,91.69 27.04,90.42 GND.TP | v26.32,9.09 26.5,9.09 28.25,7.34 R26.2 29.16,6.44 30.8,4.8 | C9.2 v18.35,83.9
  Bottom 0.508: C2.2 42.37,70.19 v41.52,69.34 | v41.77,64.77 42.03,65.03 U2.4 | C1.2 14.68,99.23 15.23,98.68 16.12,98.68
  other vias: 4.18,99.31 21.45,95.5 33.65,2.36 14.25,23.95 25.51,35.31 25.66,32.18 22.21,32.13 80.12,13.97 50.98,1.02 22.47,1.02 8.75,13.21 0.88,21.08 80.12,83.82 6.46,33.08 9.42,36.33 9,38.74 5.19,35.19 17.89,41.98 26.76,51.04 16.85,44.78 20.92,48.85 24.73,52.66 30.57,51.05 25.74,46.2 23.74,39.1 22.2,36.63 19.41,33.84 28.81,43.43 28.81,34.81 28.81,28.54 24.47,22.15 26.52,12.7 24.49,10.43 20.18,14.99 34.91,50.05 42.79,64 36.97,56.64 38.21,59.94 42.52,56.9 46.32,59.17 51.42,61.46 47.33,54.86 40.99,52.58 31.64,43.43 34.14,35.06 26.39,20.81 31.79,11.73 53.2,62.75 54.95,54.86 51.14,54.86 43.52,54.86 46.09,43.43 49.14,43.43 34.67,42.93 41.49,49.79 31.67,39.56 46.84,35.06 28.42,20.81 48.09,20.56 36.42,11.53 35.93,2.54 47.17,11.58 49.87,20.56 48.39,36.83 57.01,30.23 53.22,23.34 58.53,15.49 51.67,8.37 61.58,15.49 61.58,19.56 75.53,24.59 72.5,24.13 70.47,22.1 63.59,22.1 58.53,31.24 52.18,38.1 52.18,43.43 58.03,50.04 62.09,46.23 66.15,42.16 70.22,38.1 74.03,37.08 69.71,41.66 65.65,45.47 61.84,49.53 58.27,53.09 55.99,62.75 53.2,66.79 44.82,62.48 49.64,62.48 80.12,40.39 80.12,45.21 80.12,57.4 80.12,62.23 75.09,112.17 80.12,106.93 16.45,112.22 5.66,112.17 0.88,107.19 1.38,85.09 1.38,80.01 0.88,62.48 0.88,57.4 0.88,45.72 0.88,41.15 0.88,33.31 53.2,83.06 53.2,74.42 53.71,90.17 59.55,92.2 68.44,82.55 69.2,76.45 69.2,59.69 74.03,54.86 77.33,54.86 80.12,26.17 72,76.45 70.73,85.6 61.33,95 53.2,94.23 50.4,93.22 45.33,95.5 45.33,97.03 45.33,98.55 40.75,101.85 36.18,101.85 30.72,98.81 24.75,94.23 24.5,100.71 11.54,105.66 13.32,100.08 13.32,102.87 12.31,89.92 12.18,96.14 26.02,86.61 45.83,86.61 45.83,90.17 31.86,90.17 42.79,86.61 42.52,81.28 34.66,81.53 28.78,81.03 19.66,79.78 9.5,79.25 5.7,81.28 5.7,83.82 8.5,86.87 8.5,89.66 5.7,95.25 4.18,101.85 6.21,105.66 9.51,103.38 10.02,105.66 13.32,105.66 18.53,105.79 19.67,109.47 60.9,110.41 69.71,109.98 49.39,101.85 53.2,101.85 49.39,98.81 53.71,98.81 59.8,98.81 65.14,99.57 68.19,98.81 31.61,109.47 40.75,109.47 49.39,109.47 17.64,94.23 34.66,86.61 37.2,90.17 40.75,90.17 43.04,78.97 38.97,74.15 33.1,64.78 66.15,89.92 63.87,87.63 73.01,89.92 73.01,95 72,60.96 49.64,67.17 39.86,65.43 43.42,68.2 58.36,110.44 62.47,108.33 60.57,108.2 80.12,30.99 24.5,91.69 16.62,91.69 14.08,90.93 9.38,98.42 20.94,105.79 30.72,93.22 14.97,77.99 47.39,72.55 47.09,14.08 49.47,13.58 41.12,8.04 48.14,68.42 46.89,65.92 33.1,67.03 28.35,67.03 28.35,64.53 28.35,62.03 31.35,62.03 28.35,59.28 30.85,59.78 33.1,59.53 31.03,79.28 31.03,74.53 31.03,72.03 31.03,69.53 47.79,82.72 31.91,86.61 28.35,57.03 28.35,69.53 28.85,72.03 28.85,74.28 21.74,46.2 23.7,34.13 23.74,43.1 26.51,36.81 22.47,16.65
  pour Top (isolate 0.254, rank 6): -4.97,116.33 83.93,116.33 85.2,115.06 85.2,11.94 63.36,-9.91 8.75,-9.91 -10.3,9.14 -10.3,111
  pour Bottom (isolate 0.254, rank 6): -9.79,109.73 -0.39,119.13 89.52,119.13 89.52,6.35 94.35,1.52 82.92,-9.91 29.83,-9.91 -9.79,29.72
LDB0
  Bottom 0.254: J1.26 J2.25
LDB1
  Bottom 0.254: J2.24 J1.27
LDB2
  Bottom 0.254: J1.28 J2.23
LDB3
  Bottom 0.254: J1.29 J2.22
LDB4
  Bottom 0.254: J1.30 J2.21
LDB5
  Bottom 0.254: J1.31 J2.20
LDG0
  Bottom 0.254: J1.20 J2.31
LDG1
  Bottom 0.254: J2.30 J1.21
LDG2
  Bottom 0.254: J1.22 J2.29
LDG3
  Bottom 0.254: J2.28 J1.23
LDG4
  Bottom 0.254: J1.24 J2.27
LDG5
  Bottom 0.254: J2.26 J1.25
LDR0
  Bottom 0.254: J1.14 J2.37
LDR1
  Bottom 0.254: J2.36 J1.15
LDR2
  Bottom 0.254: J1.16 J2.35
LDR3
  Bottom 0.254: J2.34 J1.17
LDR4
  Bottom 0.254: J1.18 J2.33
LDR5
  Bottom 0.254: J2.32 J1.19
LED_CTRL
  Bottom 0.254: R9.1 26.27,42.38 26.27,43.95 36.1,53.79 36.1,60.37 42.03,66.3 U2.3
LP
  Bottom 0.254: J2.16 J1.35
N$1  (via drill 0.33)
  Top 0.254: v8.5,109.73 8.5,98.04 v8.24,97.79
  Bottom 0.254: v8.5,109.73 9.17,109.05 R2.1 13.58,109.05 Q1.3 | v8.24,97.79 6.38,97.79 R1.2
N$2
  Bottom 0.254: R1.1 6.72,96.43 6.72,92.71 7.86,91.57 LED1.K
N$3  (via drill 0.33)
  Top 0.254: v16.88,109.98 16.88,109.22 16.51,108.85 v16.51,97.69 v16.52,97.69
  Bottom 0.254: R6.2 8.08,103.38 8.08,102.49 9.35,101.22 U1.7 9.38,101.22 9.13,100.97 9.13,100.2 9.38,99.95 U1.6 12.43,99.95 14.7,97.69 v16.52,97.69 | BATTERY_LVL.TP 61.45,108.58 58.13,111.91 18.81,111.91 v16.88,109.98
N$4  (via drill 0.33)
  Top 0.254: v43.65,2.07 43.98,2.07 LED13.1 | v59.55,18.54 59.45,18.64 LED16.3
  Bottom 0.254: v43.65,2.07 43.81,2.23 R27.1 49.29,4.72 59.55,14.99 v59.55,18.54
N$5  (via drill 0.33)
  Top 0.254: LED16.1 57.55,20.83 v56.5,20.83 | v73.52,25.4 73.93,25.81 LED15.3
  Bottom 0.254: v73.52,25.4 73.52,23.62 70.98,21.08 56.76,21.08 v56.5,20.83 57.8,19.53 R28.1
N$6  (via drill 0.33)
  Top 0.254: LED10.1 12.29,31.75 v12.22,31.82 | v10.95,29.03 10.95,28.26 LED14.3
  Bottom 0.254: R22.1 14.59,34.2 v12.22,31.82 10.44,30.05 10.44,29.53 v10.95,29.03
N$7
  Bottom 0.254: U1.2 19.96,101.22 R5.1 R8.2 19.67,98.39 19.67,95.16 C8.1
N$9  (via drill 0.33)
  Top 0.254: LED14.1 9.75,25.29 v9.68,25.22 | v12.47,23.95 13.25,23.95 LED11.3
  Bottom 0.254: R23.1 8.33,26.57 v9.68,25.22 11.2,25.22 v12.47,23.95
N$10  (via drill 0.33)
  Top 0.254: LED11.1 16.35,22.75 v16.78,23.18 | v17.3,25.22 17.3,26 LED12.3
  Bottom 0.254: R24.1 14.6,19.98 16.28,21.66 16.28,22.68 v16.78,23.18 17.3,23.69 v17.3,25.22
N$11  (via drill 0.33)
  Top 0.254: LED12.1 18.75,29.21 v18.82,29.28 | v21.62,22.42 v21.62,19.88 | v32.63,2.54 32.47,2.38 LED17.3
  Bottom 0.254: v18.82,29.28 22.31,29.28 R25.1 22.64,28.54 21.62,27.52 v21.62,22.42 | v21.62,19.88 21.62,16.09 32.63,5.08 v32.63,2.54
N$12  (via drill 0.33)
  Top 0.254: LED17.1 28.17,1.52 v28.05,1.52 | v47.36,1.52 46.55,2.33 LED13.3
  Bottom 0.254: R26.1 28.05,4.54 v28.05,1.52 29.07,0.51 33.22,0.51 34.12,1.41 36.41,1.41 37.11,2.11 42.67,2.11 43.45,1.33 47.17,1.33 v47.36,1.52
N$13  (via drill 0.33)
  Top 0.254: LED15.1 71.05,27.62 v70.98,27.69
  Bottom 0.254: v70.98,27.69 67.4,27.69 R29.1
N$14  (via drill 0.33)
  Top 0.254: v16.28,30.55 15.24,30.55 LED10.3
  Bottom 0.254: R9.2 26.64,40.31 26.64,38.31 19.39,31.05 16.78,31.05 v16.28,30.55
N$15
  Bottom 0.254: R11.1 R12.2 C6.1 15.19,95.76 12.27,98.68 U1.5
N$19  (via drill 0.6)
  Bottom 0.508: C3TH.- 75.07,80.29 C3.- 70.98,80.03 70.98,60.45 76.31,55.12 76.31,40.13 77.58,38.86 77.58,24.05 v73.4,19.87 73.4,15.97 TP2.TP
N$20
  Bottom 0.254: R8.1 22.3,98.47 R13.2
N$21  (via drill 0.33)
  Top 0.254: v18.91,100.33 18.91,101.6 v19.42,102.11
  Bottom 0.254: R6.1 5.45,104.31 5.45,103.97 7.06,102.36 R7.2 C7.1 7.09,99.28 12.46,99.28 14.97,96.77 17.64,96.77 19.04,98.17 19.04,99.44 18.53,99.95 | U1.3 18.53,99.95 | v18.91,100.33 18.53,99.95 | v19.42,102.11 19.42,102.62 20.52,103.72 R3.2
N$31
  Bottom 0.254: R4.2 20.52,106.6 18.82,104.9 R3.1 18.82,103.38 17.93,102.49 U1.1
P00  (via drill 0.33)
  Top 0.254: v49.01,83.44 49.01,82.3 v49.77,81.53 | v41.01,59.67 41.01,59.92 38.29,62.64 v36.99,62.64 33.89,62.64 33.51,62.25 v32.5,62.25 | RIGHT.P$1 26.4,29.74 26.4,27.27 26.42,27.25 v27.97,27.25
  Bottom 0.254: v27.97,27.25 27.79,27.42 27.79,44.22 36.44,52.86 39.61,52.86 TP_R.TP 41.61,59.07 v41.01,59.67 | v49.77,81.53 50.02,81.28 50.02,76.58 39.74,66.29 U2.6 37.33,66.29 36.79,65.76 36.79,64.49 36.99,64.29 v36.99,62.64 | J2.10 49.26,91.61 49.26,83.69 v49.01,83.44 | v32.5,62.25 32.5,61.45 31.7,60.65 25.29,60.65 J3.5
P01  (via drill 0.33)
  Top 0.254: v36.26,63.91 34.05,63.91 v33.95,64.01 | LEFT.P$1 2.1,24.76 2.1,32.02 2.63,32.55 v3.57,32.55
  Bottom 0.254: v3.57,32.55 4.39,32.55 14.67,42.83 16.51,42.83 26.45,52.77 28.09,52.77 TP_L.TP 30.36,54.86 33.95,58.45 v33.95,64.01 | U2.7 37.2,67.56 36.36,66.72 36.36,63.91 v36.26,63.91 | J2.9 49.79,88.52 49.7,88.43 49.7,83.09 34.67,68.06 34.67,65.42 33.95,64.7 v33.95,64.01 | v33.95,64.01 33.94,64 32.83,64 32.03,63.2 J3.4
P02  (via drill 0.33)
  Top 0.254: 11.25,38.89 UP.P$1 11.1,39.04 11.1,39.39 14.2,39.39 14.25,39.44 14.25,40.46 v15.52,41.73
  Bottom 0.254: v15.52,41.73 16.02,41.73 26.63,52.34 32.33,52.34 33.99,54 TP_U.TP 34.6,55.47 34.6,64.6 35.1,65.1 35.1,67.88 50.13,82.91 50.13,88.25 50.29,88.41 J2.8
P03  (via drill 0.33)
  Top 0.254: DOWN.P$1 16.76,15.12 14.3,15.12 14.25,15.07 v14.25,13.53
  Bottom 0.254: v14.25,13.53 27.28,26.56 27.28,44.34 TP_D.TP 37.8,57.61 43.94,63.75 48.12,63.75 50.56,66.2 50.56,88.07 50.79,88.3 J2.7
P10  (via drill 0.33)
  Top 0.254: v52.95,65.52 51.14,65.52 v50.64,65.02 | A.P$1 70.5,35.25 73,35.25 73.01,35.26 v73.01,36.83
  Bottom 0.254: v73.01,36.83 72.89,36.83 56.85,52.86 TP_A.TP 56.85,56.36 54.85,58.36 54.85,63.62 v52.95,65.52 | OSD_A_PAD.TP 69.08,101.73 65.39,98.04 61.77,98.04 61.26,97.54 53.07,97.54 51.29,95.75 J2.6 51.29,88.19 50.99,87.89 50.99,65.38 v50.64,65.02
P11  (via drill 0.33)
  Top 0.254: v52.96,61.15 52.96,61.2 v50.66,63.5 | v62.09,97.18 v62.09,98.7 | B.P$1 55.5,28.5 58.5,28.5 58.5,29.94 v58.53,29.97
  Bottom 0.254: v58.53,29.97 51.04,37.47 51.04,52.86 TP_B.TP 52.96,54.95 v52.96,61.15 | v50.66,63.5 51.43,64.27 51.43,87.71 51.79,88.08 J2.5 51.79,95.62 53.2,97.03 61.94,97.03 v62.09,97.18 | OSD_B_PAD.TP 65.27,101.62 62.34,98.7 v62.09,98.7
P12  (via drill 0.33, 0.35)
  Top 0.254: v42.53,59.69 42.28,59.69 v38.21,63.75 38.01,63.55 36.9,63.55 36.55,63.2 33.45,63.2 v33.25,63 | v25.55,9.7 25.55,10.2 27.4,12.05 v27.5,12.05 | SELECT.P$2 26.83,1.27 v27.25,0.85
  Bottom 0.254: TP_SEL.TP 44.92,54.86 32.66,42.6 32.66,29.46 27.5,24.3 v27.5,12.05 | U2.5 38.21,64.93 38.21,64.88 v38.21,63.75 | v42.53,59.69 45.42,56.8 TP_SEL.TP | TP_SEL.TP 45.42,56.86 51.86,63.3 51.86,87.53 52.29,87.97 J2.4 52.29,95.36 53.45,96.52 62.36,96.52 63.45,97.61 68.77,97.61 72.89,101.73 OSD_SEL_PAD.TP | v27.25,0.85 27.25,7.1 25.37,8.97 25.37,9.52 v25.55,9.7 | v33.25,63 33.25,60.95 30.4,58.1 25.3,58.1 J3.6
P13  (via drill 0.35)
  Top 0.254: v37.5,1.42 37.5,2.9 v37.4,3 | START.P$2 42.03,1.8 42.39,1.45 v42.4,1.45
  Bottom 0.254: J2.3 52.79,87.86 52.29,87.36 52.29,69.25 52.29,57.92 SP_ST.TP 47.23,52.86 47.23,36.36 48.98,34.61 48.98,14.58 v37.4,3 | v42.4,1.45 42.14,1.19 37.5,1.19 v37.5,1.42
PSU_EN
  Bottom 0.254: R4.1 18.74,107.1 Q1.1
PUSH  (via drill 0.33)
  Top 0.254: v45.93,81.13 45.83,81.03 45.83,68.44 v46.72,67.56 | v30.75,90.15 v30.75,82.35
  Bottom 0.254: SW1.T 12.07,82.57 R10.1 12.09,81.88 12.49,81.48 14.28,81.48 15.35,82.55 17.39,82.55 | U2.2 46.73,67.57 v46.72,67.56 48.31,67.56 49.25,68.5 SJ1.2 | v45.93,81.13 43.95,81.13 42.53,82.55 30.75,82.55 | 17.39,82.55 30.75,82.55 | PUSH.TP 17.39,82.55 | J2.47 30.79,90.19 v30.75,90.15 | v30.75,82.35 30.75,82.55
ROCK_DOWN  (via drill 0.35)
  Top 0.254: v33.75,93 33.75,82.55 v33.05,81.85
  Bottom 0.254: SW1.2 12.03,80.07 C5.2 12.09,80.61 12.48,81 15.29,81 16.79,79.5 18.05,79.5 20.62,82.07 29.97,82.07 30.43,81.6 32.8,81.6 v33.05,81.85 | J2.41 33.79,92.96 v33.75,93
ROCK_UP
  Bottom 0.254: SW1.1 12.07,85.07 C4.2
SPK+
  Bottom 0.254: J2.2 53.29,92.93 54.34,93.98
  Bottom 0.508: 54.34,93.98 60.54,93.98 C3.+ 77.1,83.29 C3TH.+
SPK-  (via drill 0.6)
  Bottom 0.254: J2.1 53.79,92.54 54.47,93.22
  Bottom 0.508: 54.47,93.22 60.13,93.22 69.46,83.9 69.46,78.74 70.22,77.98 70.22,60.2 75.55,54.86 75.55,39.62 76.82,38.35 76.82,24.59 72.15,19.92 v72.15,19.87 72.15,15.95 TP1.TP
SPL
  Bottom 0.254: J1.13 J2.38
SPS
  Bottom 0.254: J2.45 J1.6
TB  (via drill 0.33)
  Top 0.254: v15.86,110.49 15.1,109.73 v15.1,85.09
  Bottom 0.254: C4.1 v15.1,85.09 C9.1 | v15.86,110.49 16.12,110.49 18.05,112.42 66.13,112.42 TOUCH_BRIGHTNESS.TP
TP  (via drill 0.33)
  Top 0.254: v15.86,109.47 15.86,81.01 v14.86,80.01
  Bottom 0.254: v14.86,80.01 C5.1 C10.1 | v15.86,109.47 14.85,110.49 10.91,110.49 TOUCH_PALETTE.TP
(copper drawn outside any net)
  shapes: Top circle x1

### Text on the board
tPlace: A | A | A | A | A | A | A | A
bPlace: LMV358 | SPEAKER
tNames: +
bNames: ROCK DOWN | TO OSD BOARD | ROCK UP | --OSD INPUTS-- | BATT | B | A | SEL | TO CPU BOARD | + | NEOPIXEL / DISABLE | 3.3V | 5V | REMOVE CABLES / FROM J1 AND / J2 BEFORE / PROGRAMMING!!! | 1 | 7 | 6 | 5 | 4 | RIGHT | DOWN | UP | LEFT | SELECT | START | B | A | NOW YOU'RE PLAYING WITH | PORTABLE POWER!
tStop: SUPPORT ORIGINAL CREATORS!
bStop: v2.4 | DMGC-IPS-01